# EAGLE design line-sensor-r2-var1b (EAGLE 9.3.1)
Assembly variants: I2C, USART, SPI

## Sheet 1 of 4
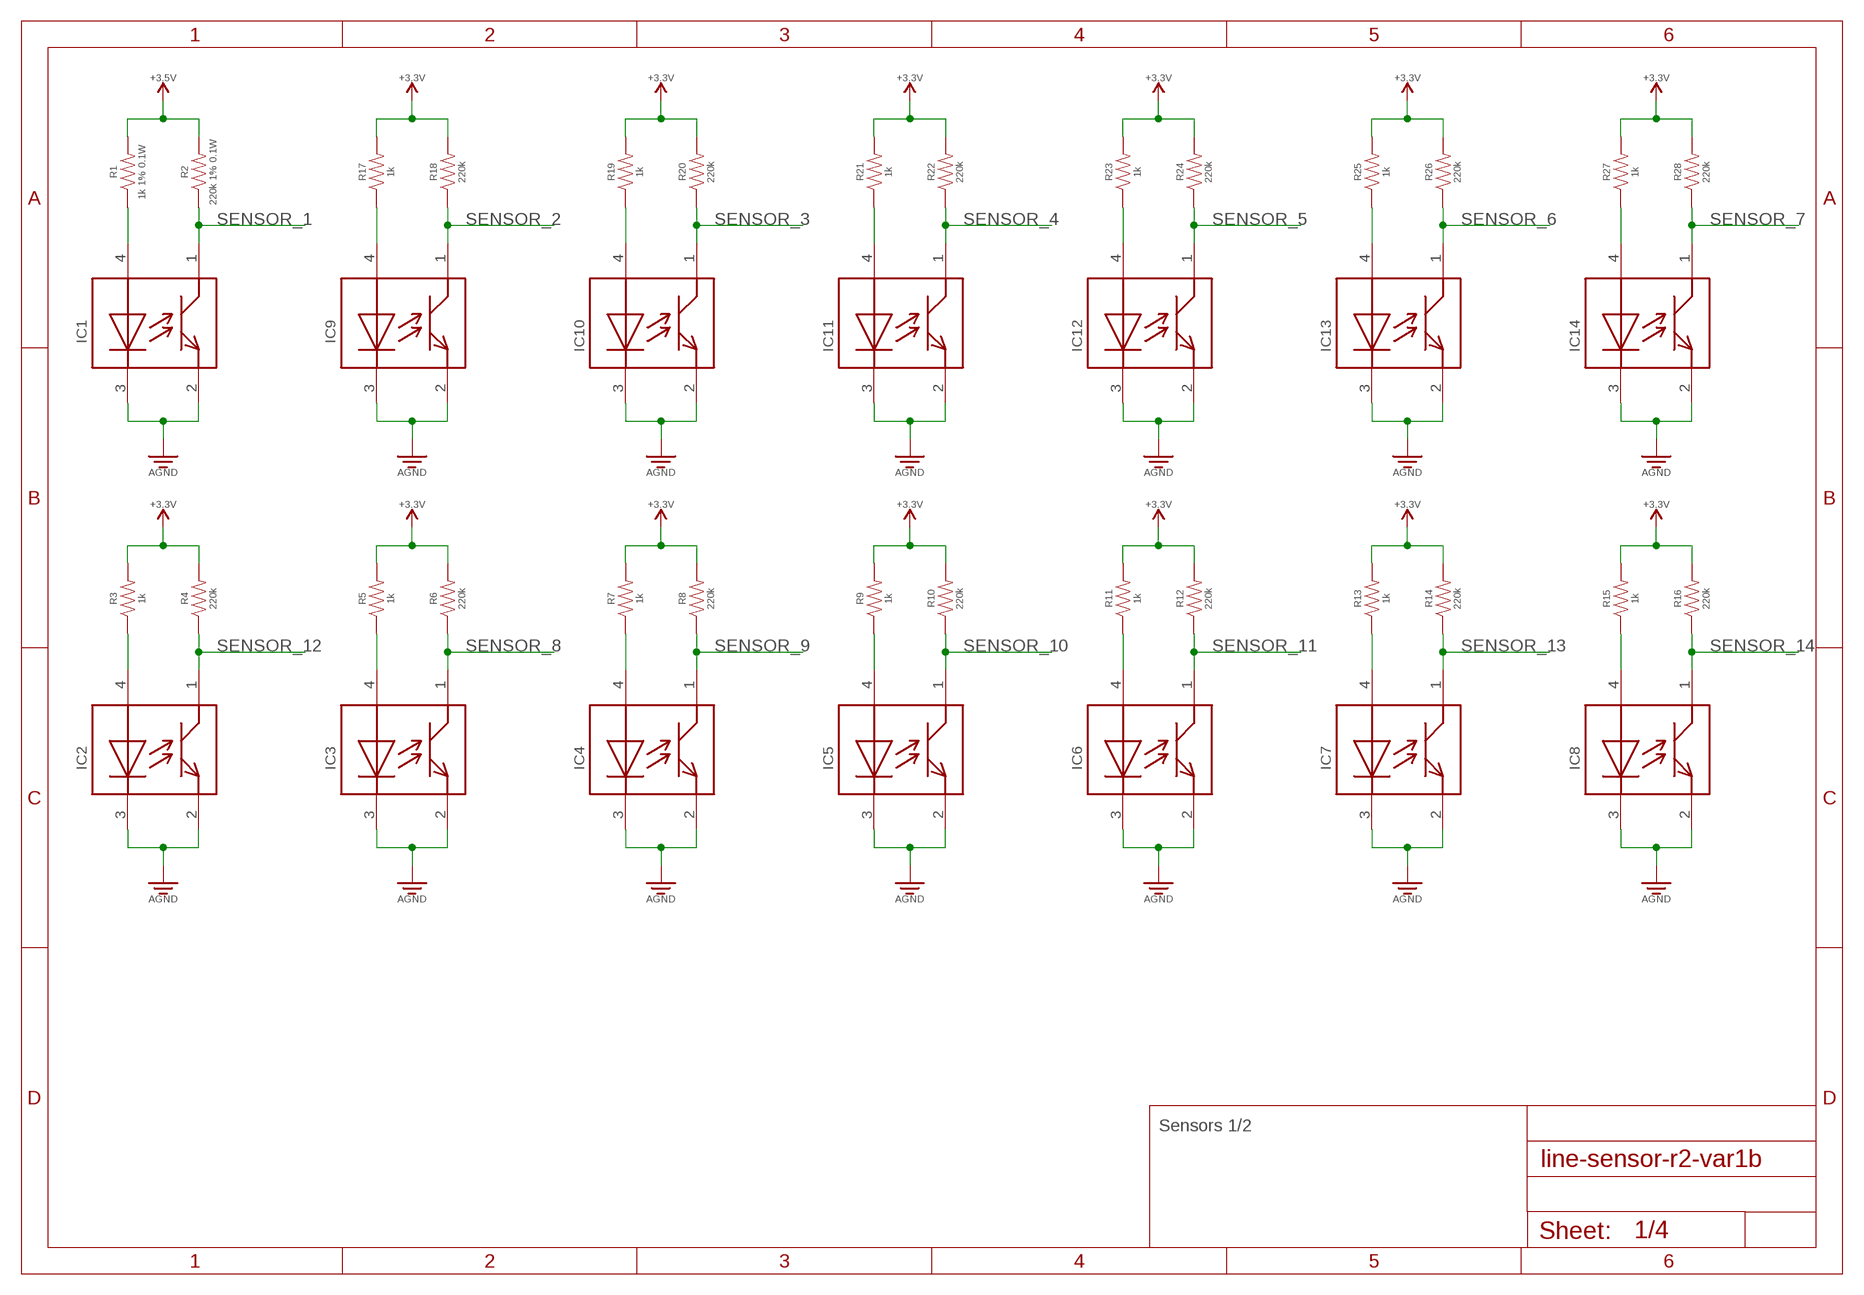
[diagram p0: schematic, sheet 1]

### Parts
IC1  GP2S60  [GP2S60]
IC2  GP2S60  [GP2S60]
IC3  GP2S60  [GP2S60]
IC4  GP2S60  [GP2S60]
IC5  GP2S60  [GP2S60]
IC6  GP2S60  [GP2S60]
IC7  GP2S60  [GP2S60]
IC8  GP2S60  [GP2S60]
IC9  GP2S60  [GP2S60]
IC10  GP2S60  [GP2S60]
IC11  GP2S60  [GP2S60]
IC12  GP2S60  [GP2S60]
IC13  GP2S60  [GP2S60]
IC14  GP2S60  [GP2S60]
R1  1k 1% 0.1W  RESISTOR_0.1W  [RESISTOR-0603]
R2  220k 1% 0.1W  RESISTOR_0.1W  [RESISTOR-0603]
R3  1k  RESISTOR_0.1W  [RESISTOR-0603]
R4  220k  RESISTOR_0.1W  [RESISTOR-0603]
R5  1k  RESISTOR_0.1W  [RESISTOR-0603]
R6  220k  RESISTOR_0.1W  [RESISTOR-0603]
R7  1k  RESISTOR_0.1W  [RESISTOR-0603]
R8  220k  RESISTOR_0.1W  [RESISTOR-0603]
R9  1k  RESISTOR_0.1W  [RESISTOR-0603]
R10  220k  RESISTOR_0.1W  [RESISTOR-0603]
R11  1k  RESISTOR_0.1W  [RESISTOR-0603]
R12  220k  RESISTOR_0.1W  [RESISTOR-0603]
R13  1k  RESISTOR_0.1W  [RESISTOR-0603]
R14  220k  RESISTOR_0.1W  [RESISTOR-0603]
R15  1k  RESISTOR_0.1W  [RESISTOR-0603]
R16  220k  RESISTOR_0.1W  [RESISTOR-0603]
R17  1k  RESISTOR_0.1W  [RESISTOR-0603]
R18  220k  RESISTOR_0.1W  [RESISTOR-0603]
R19  1k  RESISTOR_0.1W  [RESISTOR-0603]
R20  220k  RESISTOR_0.1W  [RESISTOR-0603]
R21  1k  RESISTOR_0.1W  [RESISTOR-0603]
R22  220k  RESISTOR_0.1W  [RESISTOR-0603]
R23  1k  RESISTOR_0.1W  [RESISTOR-0603]
R24  220k  RESISTOR_0.1W  [RESISTOR-0603]
R25  1k  RESISTOR_0.1W  [RESISTOR-0603]
R26  220k  RESISTOR_0.1W  [RESISTOR-0603]
R27  1k  RESISTOR_0.1W  [RESISTOR-0603]
R28  220k  RESISTOR_0.1W  [RESISTOR-0603]
SUPPLY2  +3.3V  (no package)
SUPPLY3  +3.3V  (no package)
SUPPLY4  +3.3V  (no package)
SUPPLY5  +3.3V  (no package)
SUPPLY6  +3.3V  (no package)
SUPPLY7  +3.3V  (no package)
SUPPLY8  +3.3V  (no package)
SUPPLY9  +3.3V  (no package)
SUPPLY10  +3.3V  (no package)
SUPPLY11  +3.3V  (no package)
SUPPLY12  +3.3V  (no package)
SUPPLY13  +3.3V  (no package)
SUPPLY14  +3.3V  (no package)
SUPPLY36  +3.5V  (no package)

### Nets
GND: IC1.2 IC1.3 IC2.2 IC2.3 IC3.2 IC3.3 IC4.2 IC4.3 IC5.2 IC5.3 IC6.2 IC6.3 IC7.2 IC7.3 IC8.2 IC8.3 IC9.2 IC9.3 IC10.2 IC10.3 IC11.2 IC11.3 IC12.2 IC12.3 IC13.2 IC13.3 IC14.2 IC14.3 ; supply symbol labelled AGND ; also sheet 2,3,4
N$1: IC9.4 R17.P$1
N$2: IC1.4 R1.P$1
N$3: IC10.4 R19.P$1
N$4: IC11.4 R21.P$1
N$5: IC12.4 R23.P$1
N$6: IC13.4 R25.P$1
N$7: IC14.4 R27.P$1
N$8: IC3.4 R5.P$1
N$9: IC4.4 R7.P$1
N$10: IC5.4 R9.P$1
N$11: IC6.4 R11.P$1
N$12: IC2.4 R3.P$1
N$13: IC7.4 R13.P$1
N$14: IC8.4 R15.P$1
SENSOR_1: IC1.1 R2.P$1 ; also sheet 3
SENSOR_2: IC9.1 R18.P$1 ; also sheet 3
SENSOR_3: IC10.1 R20.P$1 ; also sheet 3
SENSOR_4: IC11.1 R22.P$1 ; also sheet 3
SENSOR_5: IC12.1 R24.P$1 ; also sheet 3
SENSOR_6: IC13.1 R26.P$1 ; also sheet 3
SENSOR_7: IC14.1 R28.P$1 ; also sheet 3
SENSOR_8: IC3.1 R6.P$1 ; also sheet 3
SENSOR_9: IC4.1 R8.P$1 ; also sheet 3
SENSOR_10: IC5.1 R10.P$1 ; also sheet 3
SENSOR_11: IC6.1 R12.P$1 ; also sheet 3
SENSOR_12: IC2.1 R4.P$1 ; also sheet 3
SENSOR_13: IC7.1 R14.P$1 ; also sheet 3
SENSOR_14: IC8.1 R16.P$1 ; also sheet 3
VDD: R1.P$2 R2.P$2 R3.P$2 R4.P$2 R5.P$2 R6.P$2 R7.P$2 R8.P$2 R9.P$2 R10.P$2 R11.P$2 R12.P$2 R13.P$2 R14.P$2 R15.P$2 R16.P$2 R17.P$2 R18.P$2 R19.P$2 R20.P$2 R21.P$2 R22.P$2 R23.P$2 R24.P$2 R25.P$2 R26.P$2 R27.P$2 R28.P$2 SUPPLY2.VCC SUPPLY3.VCC SUPPLY4.VCC SUPPLY5.VCC SUPPLY6.VCC SUPPLY7.VCC SUPPLY8.VCC SUPPLY9.VCC SUPPLY10.VCC SUPPLY11.VCC SUPPLY12.VCC SUPPLY13.VCC SUPPLY14.VCC SUPPLY36.VCC ; also sheet 2,3,4

### Notes on the sheet
- Sensors 1/2

## Sheet 2 of 4
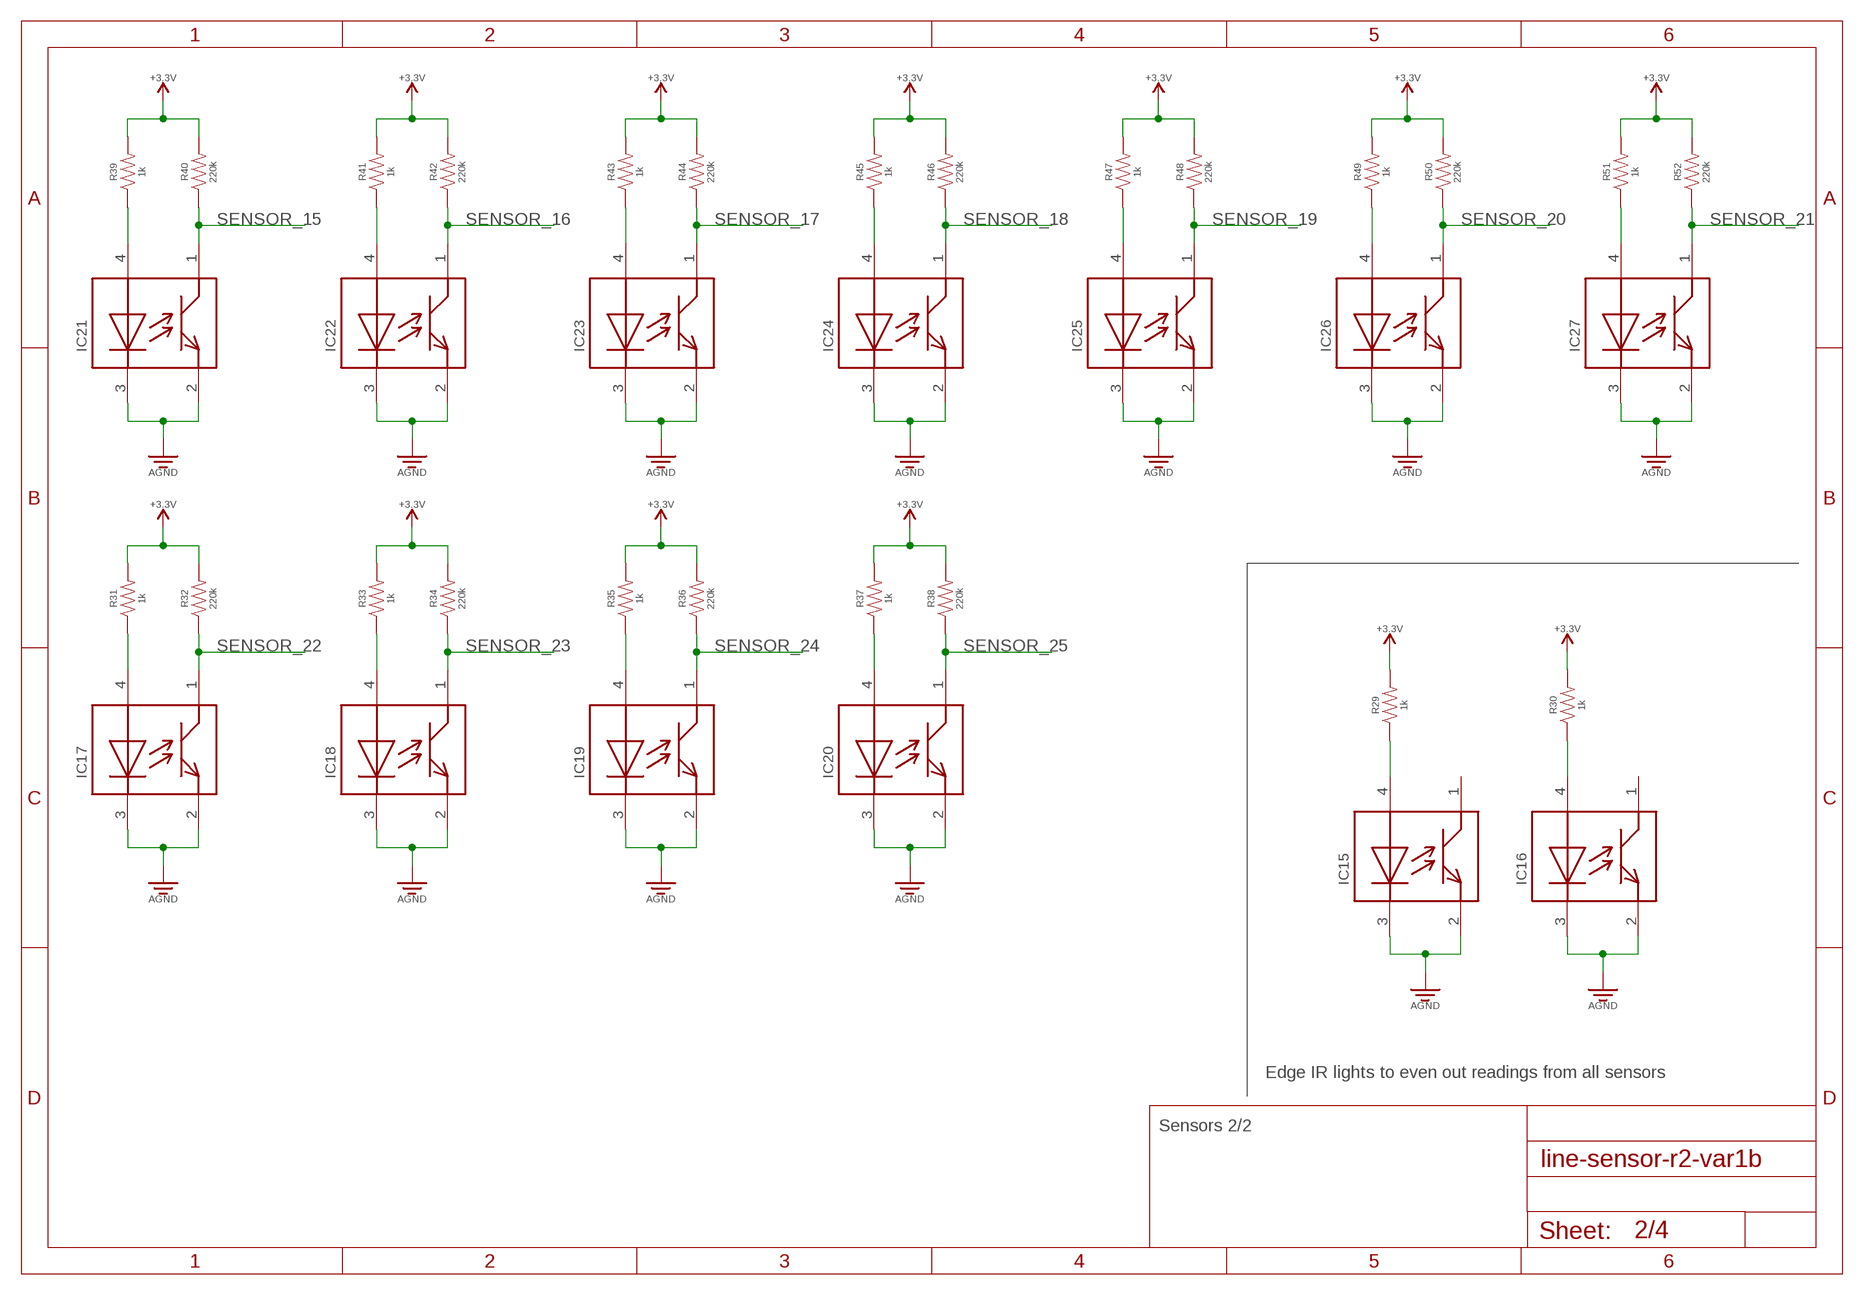
[diagram p1: schematic, sheet 2]

### Parts
IC15  GP2S60  [GP2S60]
IC16  GP2S60  [GP2S60]
IC17  GP2S60  [GP2S60]
IC18  GP2S60  [GP2S60]
IC19  GP2S60  [GP2S60]
IC20  GP2S60  [GP2S60]
IC21  GP2S60  [GP2S60]
IC22  GP2S60  [GP2S60]
IC23  GP2S60  [GP2S60]
IC24  GP2S60  [GP2S60]
IC25  GP2S60  [GP2S60]
IC26  GP2S60  [GP2S60]
IC27  GP2S60  [GP2S60]
R29  1k  RESISTOR_0.1W  [RESISTOR-0603]
R30  1k  RESISTOR_0.1W  [RESISTOR-0603]
R31  1k  RESISTOR_0.1W  [RESISTOR-0603]
R32  220k  RESISTOR_0.1W  [RESISTOR-0603]
R33  1k  RESISTOR_0.1W  [RESISTOR-0603]
R34  220k  RESISTOR_0.1W  [RESISTOR-0603]
R35  1k  RESISTOR_0.1W  [RESISTOR-0603]
R36  220k  RESISTOR_0.1W  [RESISTOR-0603]
R37  1k  RESISTOR_0.1W  [RESISTOR-0603]
R38  220k  RESISTOR_0.1W  [RESISTOR-0603]
R39  1k  RESISTOR_0.1W  [RESISTOR-0603]
R40  220k  RESISTOR_0.1W  [RESISTOR-0603]
R41  1k  RESISTOR_0.1W  [RESISTOR-0603]
R42  220k  RESISTOR_0.1W  [RESISTOR-0603]
R43  1k  RESISTOR_0.1W  [RESISTOR-0603]
R44  220k  RESISTOR_0.1W  [RESISTOR-0603]
R45  1k  RESISTOR_0.1W  [RESISTOR-0603]
R46  220k  RESISTOR_0.1W  [RESISTOR-0603]
R47  1k  RESISTOR_0.1W  [RESISTOR-0603]
R48  220k  RESISTOR_0.1W  [RESISTOR-0603]
R49  1k  RESISTOR_0.1W  [RESISTOR-0603]
R50  220k  RESISTOR_0.1W  [RESISTOR-0603]
R51  1k  RESISTOR_0.1W  [RESISTOR-0603]
R52  220k  RESISTOR_0.1W  [RESISTOR-0603]
SUPPLY15  +3.3V  (no package)
SUPPLY16  +3.3V  (no package)
SUPPLY17  +3.3V  (no package)
SUPPLY18  +3.3V  (no package)
SUPPLY19  +3.3V  (no package)
SUPPLY20  +3.3V  (no package)
SUPPLY21  +3.3V  (no package)
SUPPLY22  +3.3V  (no package)
SUPPLY23  +3.3V  (no package)
SUPPLY24  +3.3V  (no package)
SUPPLY25  +3.3V  (no package)
SUPPLY26  +3.3V  (no package)
SUPPLY27  +3.3V  (no package)

### Nets
GND: IC15.2 IC15.3 IC16.2 IC16.3 IC17.2 IC17.3 IC18.2 IC18.3 IC19.2 IC19.3 IC20.2 IC20.3 IC21.2 IC21.3 IC22.2 IC22.3 IC23.2 IC23.3 IC24.2 IC24.3 IC25.2 IC25.3 IC26.2 IC26.3 IC27.2 IC27.3 ; supply symbol labelled AGND ; also sheet 1,3,4
N$15: IC21.4 R39.P$1
N$16: IC22.4 R41.P$1
N$17: IC23.4 R43.P$1
N$18: IC24.4 R45.P$1
N$19: IC25.4 R47.P$1
N$20: IC26.4 R49.P$1
N$21: IC27.4 R51.P$1
N$22: IC17.4 R31.P$1
N$23: IC18.4 R33.P$1
N$24: IC19.4 R35.P$1
N$25: IC20.4 R37.P$1
N$30: IC16.4 R30.P$1
N$31: IC15.4 R29.P$1
SENSOR_15: IC21.1 R40.P$1 ; also sheet 3
SENSOR_16: IC22.1 R42.P$1 ; also sheet 3
SENSOR_17: IC23.1 R44.P$1 ; also sheet 3
SENSOR_18: IC24.1 R46.P$1 ; also sheet 3
SENSOR_19: IC25.1 R48.P$1 ; also sheet 3
SENSOR_20: IC26.1 R50.P$1 ; also sheet 3
SENSOR_21: IC27.1 R52.P$1 ; also sheet 3
SENSOR_22: IC17.1 R32.P$1 ; also sheet 3
SENSOR_23: IC18.1 R34.P$1 ; also sheet 3
SENSOR_24: IC19.1 R36.P$1 ; also sheet 3
SENSOR_25: IC20.1 R38.P$1 ; also sheet 3
VDD: R29.P$2 R30.P$2 R31.P$2 R32.P$2 R33.P$2 R34.P$2 R35.P$2 R36.P$2 R37.P$2 R38.P$2 R39.P$2 R40.P$2 R41.P$2 R42.P$2 R43.P$2 R44.P$2 R45.P$2 R46.P$2 R47.P$2 R48.P$2 R49.P$2 R50.P$2 R51.P$2 R52.P$2 SUPPLY15.VCC SUPPLY16.VCC SUPPLY17.VCC SUPPLY18.VCC SUPPLY19.VCC SUPPLY20.VCC SUPPLY21.VCC SUPPLY22.VCC SUPPLY23.VCC SUPPLY24.VCC SUPPLY25.VCC SUPPLY26.VCC SUPPLY27.VCC ; also sheet 1,3,4
Unconnected: IC15.1 IC16.1

### Notes on the sheet
- Edge IR lights to even out readings from all sensors
- Sensors 2/2

## Sheet 3 of 4
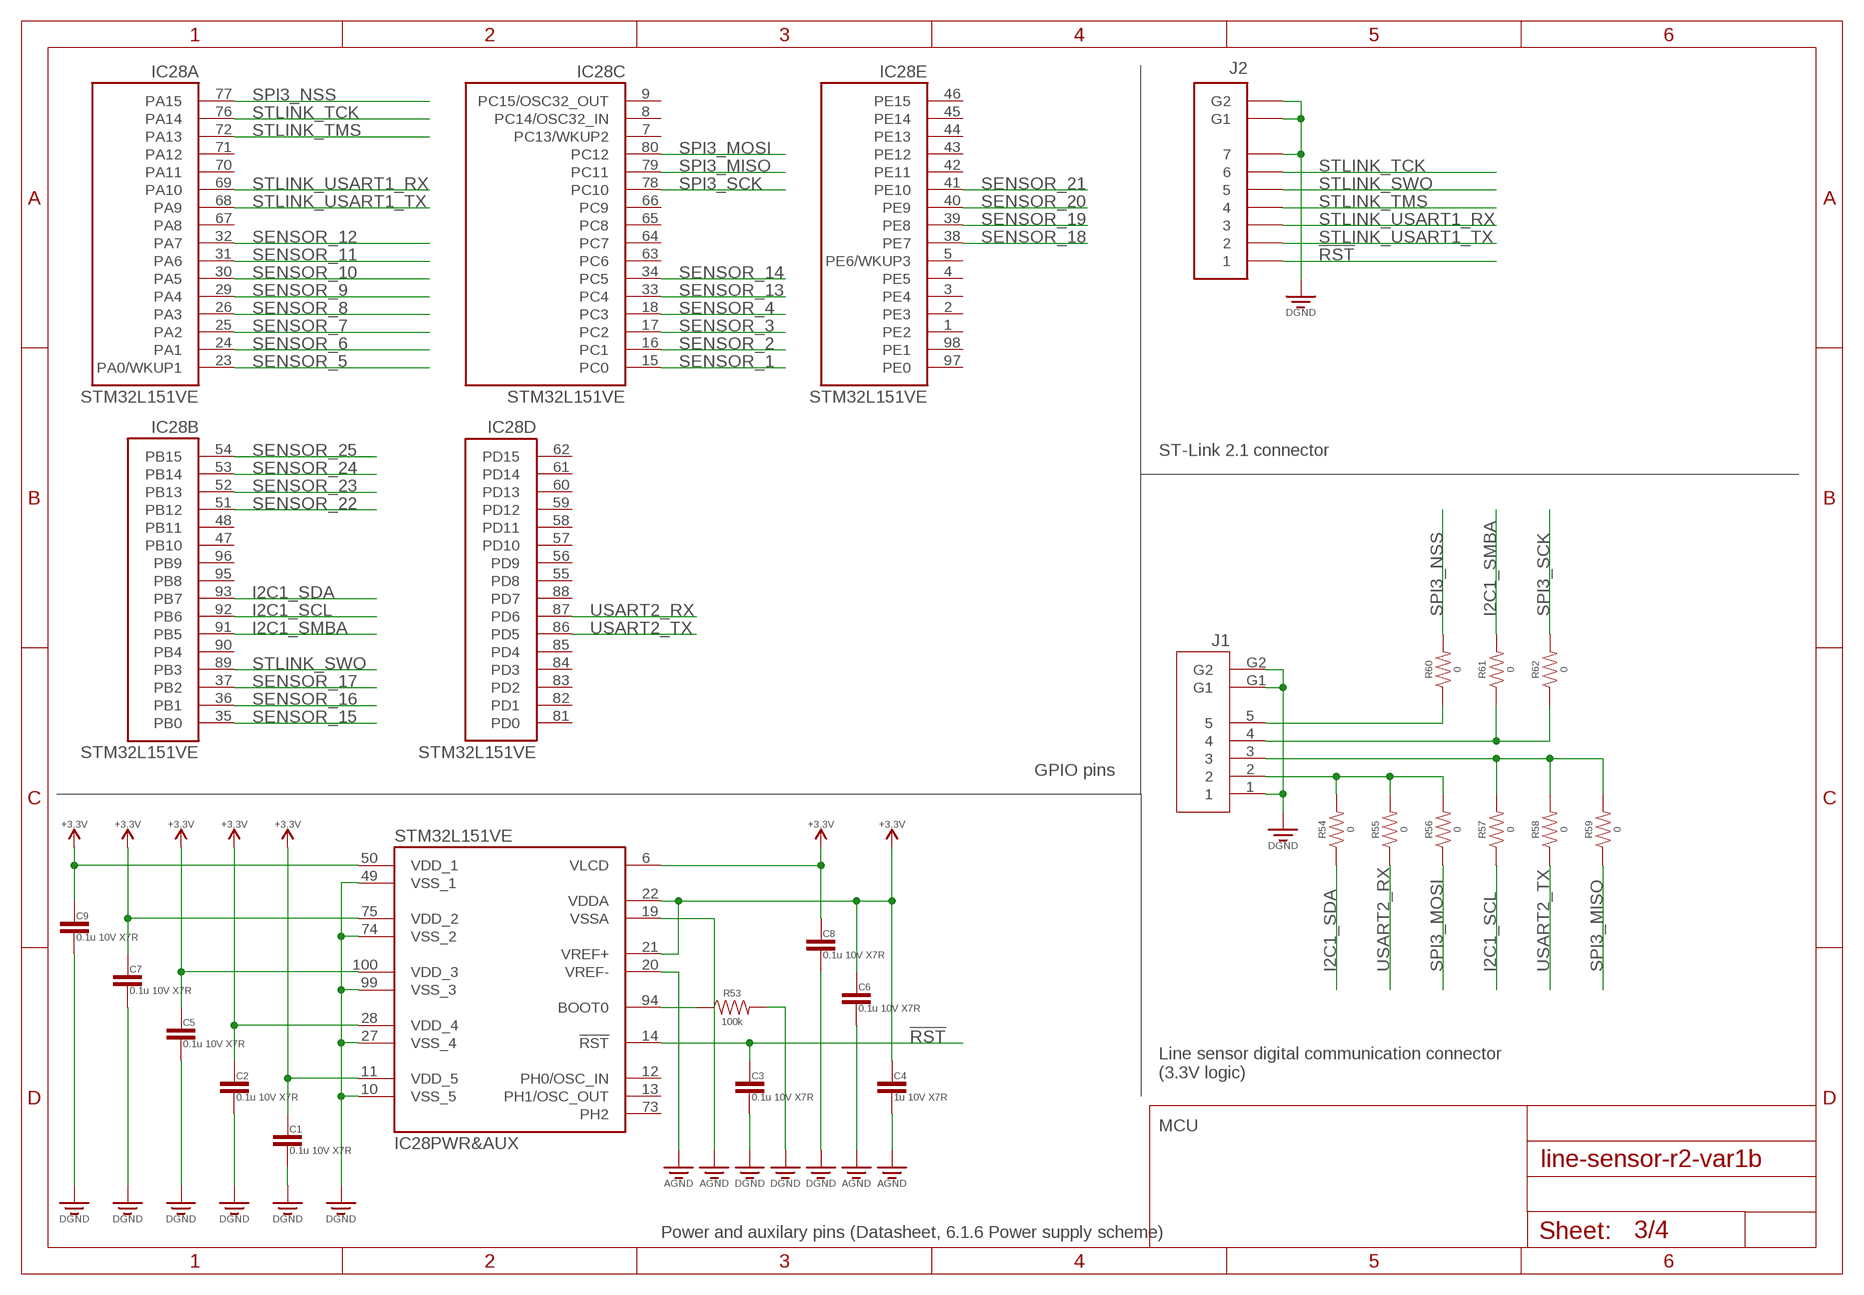
[diagram p2: schematic, sheet 3]

### Parts
C1  0.1u 10V X7R  CAPACITOR0603  [CAPACITOR-0603]
C2  0.1u 10V X7R  CAPACITOR0603  [CAPACITOR-0603]
C3  0.1u 10V X7R  CAPACITOR0603  [CAPACITOR-0603]
C4  1u 10V X7R  CAPACITOR0603  [CAPACITOR-0603]
C5  0.1u 10V X7R  CAPACITOR0603  [CAPACITOR-0603]
C6  0.1u 10V X7R  CAPACITOR0603  [CAPACITOR-0603]
C7  0.1u 10V X7R  CAPACITOR0603  [CAPACITOR-0603]
C8  0.1u 10V X7R  CAPACITOR0603  [CAPACITOR-0603]
C9  0.1u 10V X7R  CAPACITOR0603  [CAPACITOR-0603]
IC28  STM32L151VE  [LQFP100_14X14]
J1  MOLEX-502382-05XX  [MOLEX-502382-05XX]
J2  MOLEX-53261-0771  [MOLEX-53261-0771]
R53  100k  RESISTOR_0.1W  [RESISTOR-0603]
R54  0  RESISTOR_0.1W  [RESISTOR-0603]  (not fitted in variant USART)  (not fitted in variant SPI)
R55  0  RESISTOR_0.1W  [RESISTOR-0603]  (not fitted in variant I2C)  (not fitted in variant SPI)
R56  0  RESISTOR_0.1W  [RESISTOR-0603]  (not fitted in variant I2C)  (not fitted in variant USART)
R57  0  RESISTOR_0.1W  [RESISTOR-0603]  (not fitted in variant USART)  (not fitted in variant SPI)
R58  0  RESISTOR_0.1W  [RESISTOR-0603]  (not fitted in variant I2C)  (not fitted in variant SPI)
R59  0  RESISTOR_0.1W  [RESISTOR-0603]  (not fitted in variant I2C)  (not fitted in variant USART)
R60  0  RESISTOR_0.1W  [RESISTOR-0603]  (not fitted in variant I2C)  (not fitted in variant USART)
R61  0  RESISTOR_0.1W  [RESISTOR-0603]  (not fitted in variant USART)  (not fitted in variant SPI)
R62  0  RESISTOR_0.1W  [RESISTOR-0603]  (not fitted in variant I2C)  (not fitted in variant USART)
SUPPLY28  +3.3V  (no package)
SUPPLY29  +3.3V  (no package)
SUPPLY30  +3.3V  (no package)
SUPPLY31  +3.3V  (no package)
SUPPLY32  +3.3V  (no package)
SUPPLY33  +3.3V  (no package)
SUPPLY34  +3.3V  (no package)

### Nets
!RST: C3.1 IC28.14(PWR&AUX:!RST!) J2.1
BOOT0: IC28.94(PWR&AUX:BOOT0) R53.P$1
GND: C1.2 C2.2 C3.2 C4.2 C5.2 C6.2 C7.2 C8.2 C9.2 IC28.10(PWR&AUX:VSS_5) IC28.19(PWR&AUX:VSSA) IC28.20(PWR&AUX:VREF-) IC28.27(PWR&AUX:VSS_4) IC28.49(PWR&AUX:VSS_1) IC28.74(PWR&AUX:VSS_2) IC28.99(PWR&AUX:VSS_3) J1.1 J1.G1 J1.G2 J2.7 J2.G1 J2.G2 R53.P$2 ; supply symbol labelled DGND, AGND ; also sheet 1,2,4
I2C1_SCL: IC28.92(B:PB6) R57.P$1
I2C1_SDA: IC28.93(B:PB7) R54.P$1
I2C1_SMBA: IC28.91(B:PB5) R61.P$2
N$26: J1.2 R54.P$2 R55.P$2 R56.P$2
N$27: J1.3 R57.P$2 R58.P$2 R59.P$2
N$28: J1.4 R61.P$1 R62.P$1
N$29: J1.5 R60.P$1
SENSOR_1: IC28.15(C:PC0) ; also sheet 1
SENSOR_2: IC28.16(C:PC1) ; also sheet 1
SENSOR_3: IC28.17(C:PC2) ; also sheet 1
SENSOR_4: IC28.18(C:PC3) ; also sheet 1
SENSOR_5: IC28.23(A:PA0/WKUP1) ; also sheet 1
SENSOR_6: IC28.24(A:PA1) ; also sheet 1
SENSOR_7: IC28.25(A:PA2) ; also sheet 1
SENSOR_8: IC28.26(A:PA3) ; also sheet 1
SENSOR_9: IC28.29(A:PA4) ; also sheet 1
SENSOR_10: IC28.30(A:PA5) ; also sheet 1
SENSOR_11: IC28.31(A:PA6) ; also sheet 1
SENSOR_12: IC28.32(A:PA7) ; also sheet 1
SENSOR_13: IC28.33(C:PC4) ; also sheet 1
SENSOR_14: IC28.34(C:PC5) ; also sheet 1
SENSOR_15: IC28.35(B:PB0) ; also sheet 2
SENSOR_16: IC28.36(B:PB1) ; also sheet 2
SENSOR_17: IC28.37(B:PB2) ; also sheet 2
SENSOR_18: IC28.38(E:PE7) ; also sheet 2
SENSOR_19: IC28.39(E:PE8) ; also sheet 2
SENSOR_20: IC28.40(E:PE9) ; also sheet 2
SENSOR_21: IC28.41(E:PE10) ; also sheet 2
SENSOR_22: IC28.51(B:PB12) ; also sheet 2
SENSOR_23: IC28.52(B:PB13) ; also sheet 2
SENSOR_24: IC28.53(B:PB14) ; also sheet 2
SENSOR_25: IC28.54(B:PB15) ; also sheet 2
SPI3_MISO: IC28.79(C:PC11) R59.P$1
SPI3_MOSI: IC28.80(C:PC12) R56.P$1
SPI3_NSS: IC28.77(A:PA15) R60.P$2
SPI3_SCK: IC28.78(C:PC10) R62.P$2
STLINK_SWO: IC28.89(B:PB3) J2.5
STLINK_TCK: IC28.76(A:PA14) J2.6
STLINK_TMS: IC28.72(A:PA13) J2.4
STLINK_USART1_RX: IC28.69(A:PA10) J2.3
STLINK_USART1_TX: IC28.68(A:PA9) J2.2
USART2_RX: IC28.87(D:PD6) R55.P$1
USART2_TX: IC28.86(D:PD5) R58.P$1
VDD: C1.1 C2.1 C4.1 C5.1 C6.1 C7.1 C8.1 C9.1 IC28.6(PWR&AUX:VLCD) IC28.11(PWR&AUX:VDD_5) IC28.21(PWR&AUX:VREF+) IC28.22(PWR&AUX:VDDA) IC28.28(PWR&AUX:VDD_4) IC28.50(PWR&AUX:VDD_1) IC28.75(PWR&AUX:VDD_2) IC28.100(PWR&AUX:VDD_3) SUPPLY28.VCC SUPPLY29.VCC SUPPLY30.VCC SUPPLY31.VCC SUPPLY32.VCC SUPPLY33.VCC SUPPLY34.VCC ; also sheet 1,2,4
Unconnected: IC28.1(E:PE2) IC28.2(E:PE3) IC28.3(E:PE4) IC28.4(E:PE5) IC28.5(E:PE6/WKUP3) IC28.7(C:PC13/WKUP2) IC28.8(C:PC14/OSC32_IN) IC28.9(C:PC15/OSC32_OUT) IC28.12(PWR&AUX:PH0/OSC_IN) IC28.13(PWR&AUX:PH1/OSC_OUT) IC28.42(E:PE11) IC28.43(E:PE12) IC28.44(E:PE13) IC28.45(E:PE14) IC28.46(E:PE15) IC28.47(B:PB10) IC28.48(B:PB11) IC28.55(D:PD8) IC28.56(D:PD9) IC28.57(D:PD10) IC28.58(D:PD11) IC28.59(D:PD12) IC28.60(D:PD13) IC28.61(D:PD14) IC28.62(D:PD15) IC28.63(C:PC6) IC28.64(C:PC7) IC28.65(C:PC8) IC28.66(C:PC9) IC28.67(A:PA8) IC28.70(A:PA11) IC28.71(A:PA12) IC28.73(PWR&AUX:PH2) IC28.81(D:PD0) IC28.82(D:PD1) IC28.83(D:PD2) IC28.84(D:PD3) IC28.85(D:PD4) IC28.88(D:PD7) IC28.90(B:PB4) IC28.95(B:PB8) IC28.96(B:PB9) IC28.97(E:PE0) IC28.98(E:PE1)

### Notes on the sheet
- ST-Link 2.1 connector
- GPIO pins
- Line sensor digital communication connector
  (3.3V logic)
- MCU
- Power and auxilary pins (Datasheet, 6.1.6 Power supply scheme)

## Sheet 4 of 4
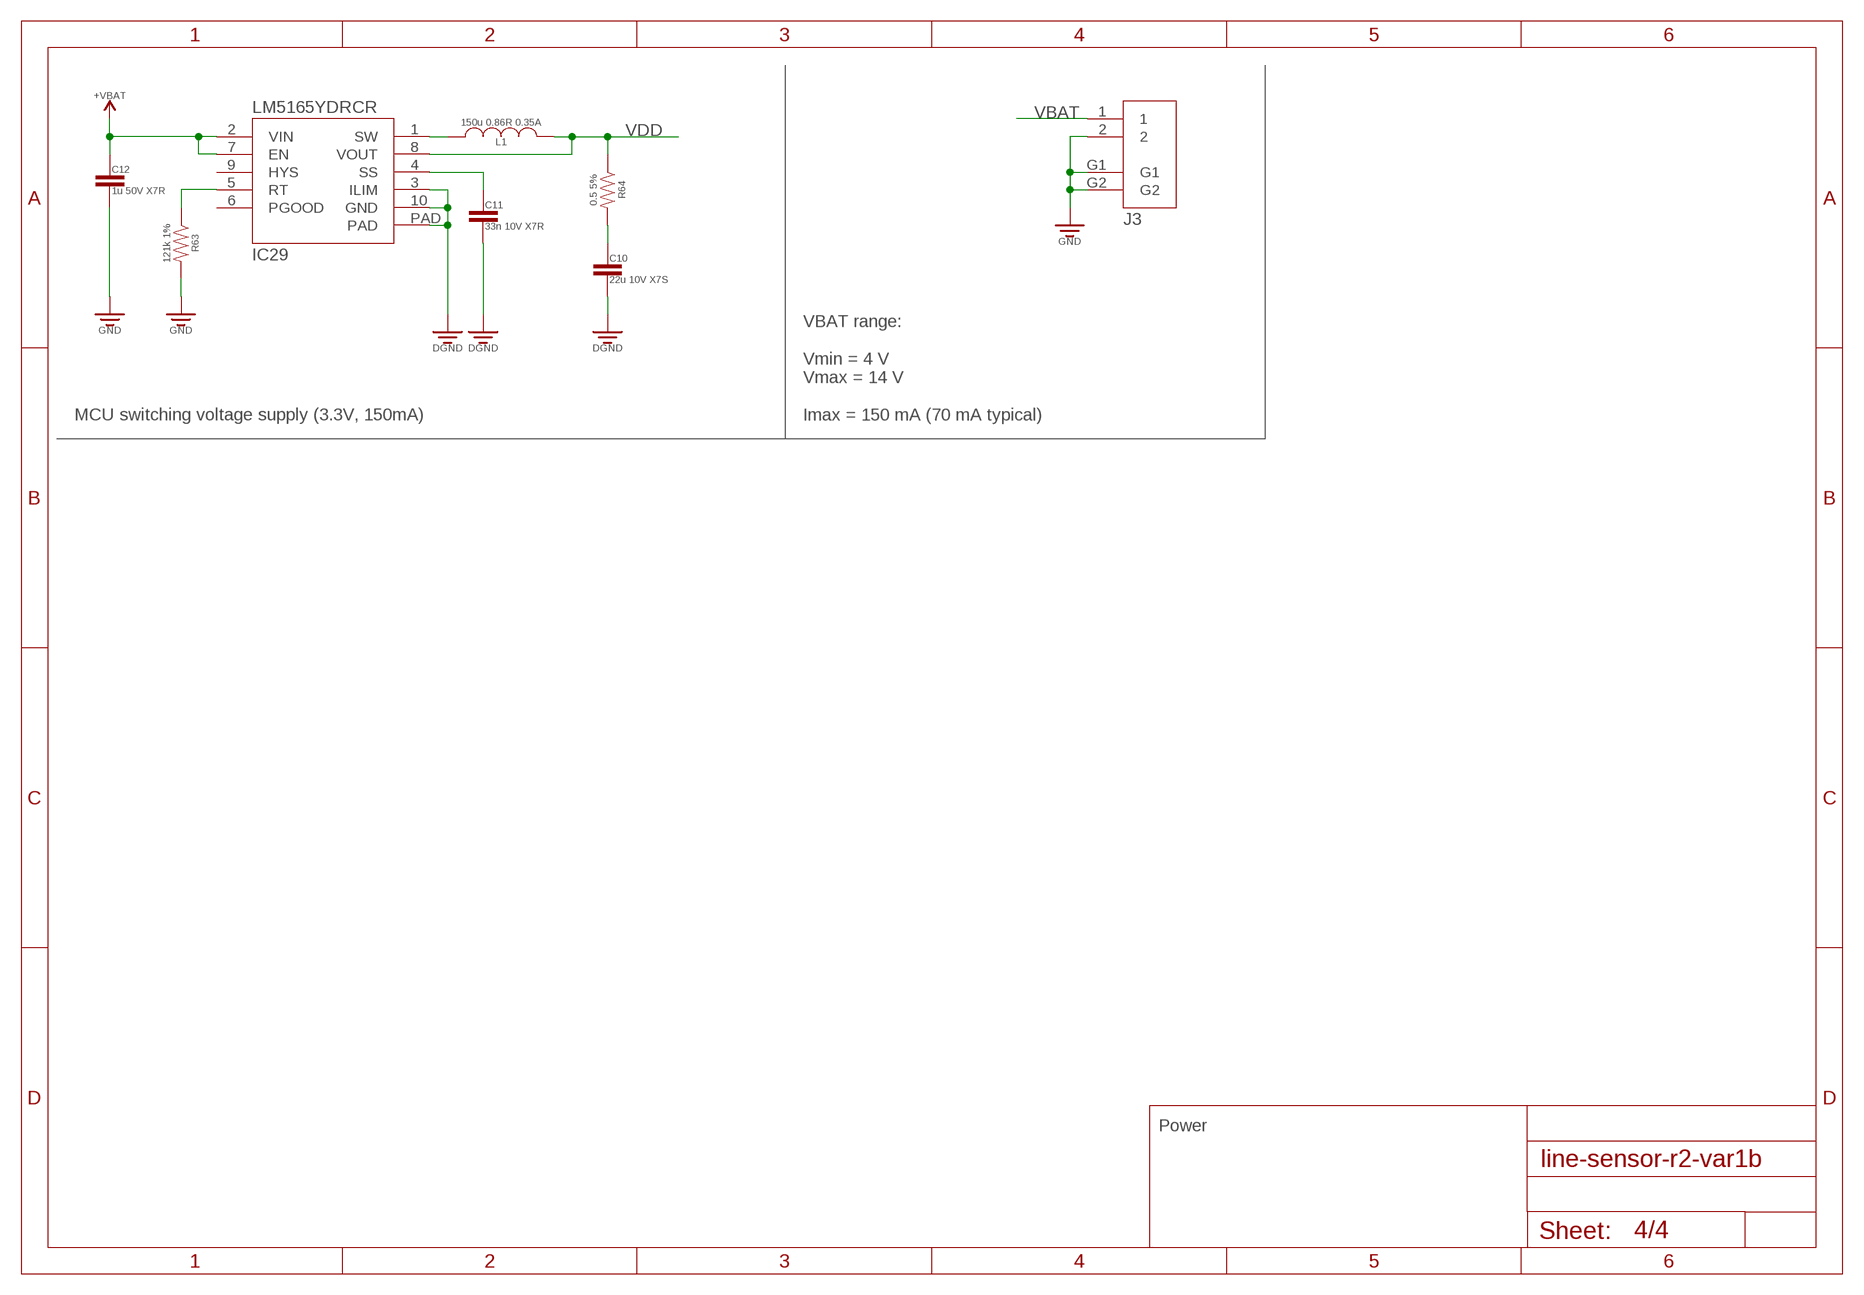
[diagram p3: schematic, sheet 4]

### Parts
C10  22u 10V X7S  CAPACITOR0805  [CAPACITOR-0805]
C11  33n 10V X7R  CAPACITOR0603  [CAPACITOR-0603]
C12  1u 50V X7R  CAPACITOR1206  [CAPACITOR-1206]
IC29  LM5165YDRCR  [VSON-10-0.5MM]
J3  MOLEX-502382-02XX  [MOLEX-502382-02XX]
L1  150u 0.86R 0.35A  INDUCTORPANASONIC-SERIES-H  [PANASONIC-SERIES-H]
R63  121k 1%  RESISTOR0603  [RESISTOR-0603]
R64  0.5 5%  RESISTOR0603  [RESISTOR-0603]
SUPPLY35  +VBAT  (no package)

### Nets
GND: C10.2 C11.2 C12.P$2 IC29.3(ILIM) IC29.10(GND) IC29.PAD J3.2 J3.G1 J3.G2 R63.P$2 ; supply symbol labelled DGND ; also sheet 1,2,3
IC32_SW: IC29.1(SW) L1.1
N$35: IC29.5(RT) R63.P$1
N$40: C11.1 IC29.4(SS)
N$42: C10.1 R64.P$2
VBAT: C12.P$1 IC29.2(VIN) IC29.7(EN) J3.1 SUPPLY35.VCC
VDD: IC29.8(VOUT) L1.2 R64.P$1 ; also sheet 1,2,3
Unconnected: IC29.6(PGOOD) IC29.9(HYS)

### Notes on the sheet
- MCU switching voltage supply (3.3V, 150mA)
- VBAT range:
  
  Vmin = 4 V
  Vmax = 14 V
  
  Imax = 150 mA (70 mA typical)
- Power

## Library data of the parts
C1-C9 = capacitors:CAPACITOR
C10-C12 = passives:CAPACITOR
IC1-IC27 = sensors:GP2S60: SMT Compact Reﬂective Photointerrupter Datasheet: http://www.sharp-world.com/products/device/lineup/data/pdf/datasheet/gp2s60_e.pdf
IC28 = mcu:STM32L151VE
IC29 = voltage-regulator:LM5165YDRCR: Texas Instruments V in: 3...65 V V out: 3.3 V I out: 150 mA Frequency: <= 600kHz
J1 = connectors:MOLEX-502382-05XX
J2 = connectors:MOLEX-53261-0771
J3 = connectors:MOLEX-502382-02XX
L1 = passives:INDUCTOR
R1-R62 = resistors:RESISTOR_0.1W
R63 R64 = passives:RESISTOR
SUPPLY2-SUPPLY34 = voltage-ground:+3.3V: +3.3V Voltage Supply Positive voltage supply (traditionally for a BJT device, C=collector).
SUPPLY35 = voltage-ground:+VBAT: +3.3V Voltage Supply Positive voltage supply (traditionally for a BJT device, C=collector).
SUPPLY36 = voltage-ground:+3.5V: +3.5V Voltage Supply Positive voltage supply (traditionally for a BJT device, C=collector).

## Net classes
1 ground: width 0.3 mm
2 3v3: width 0.3 mm

## Board
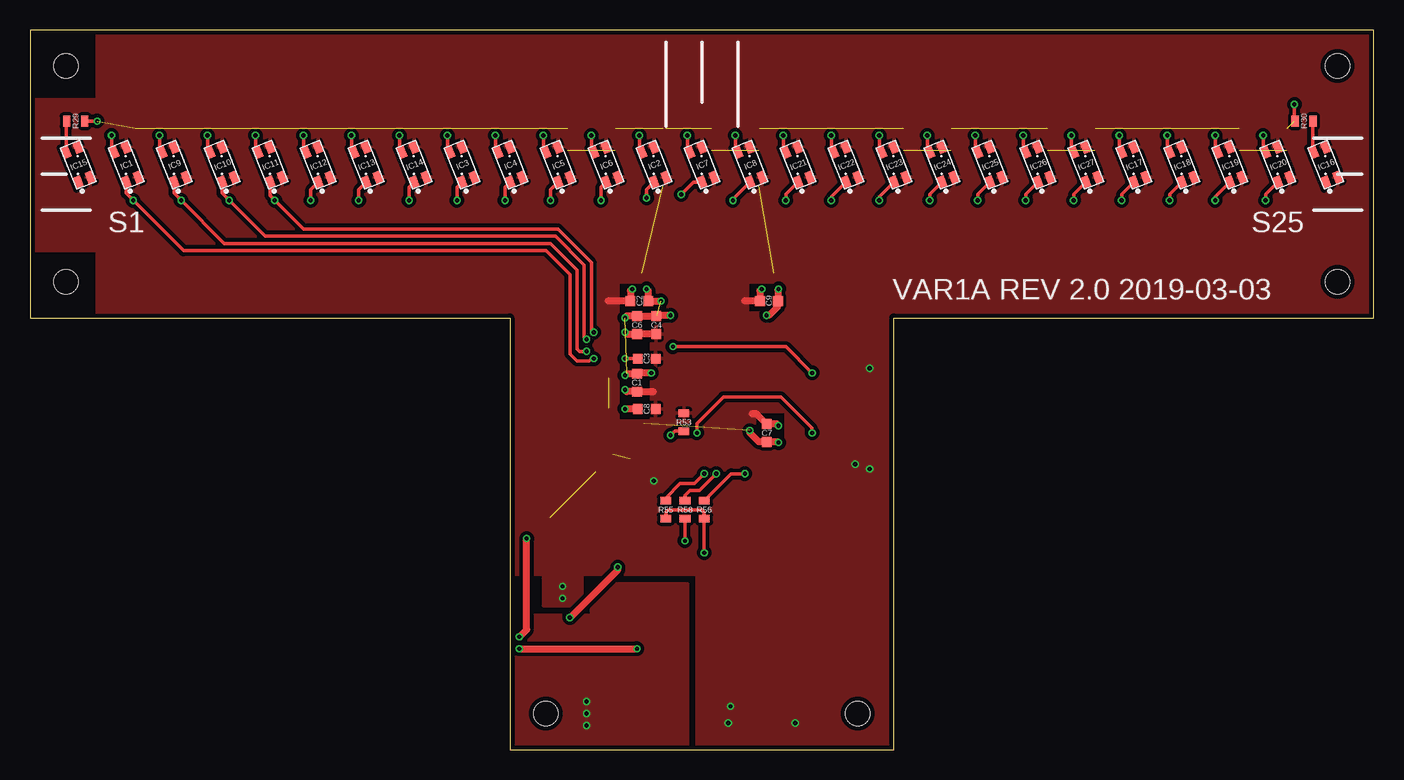
[diagram p4: board, top side]
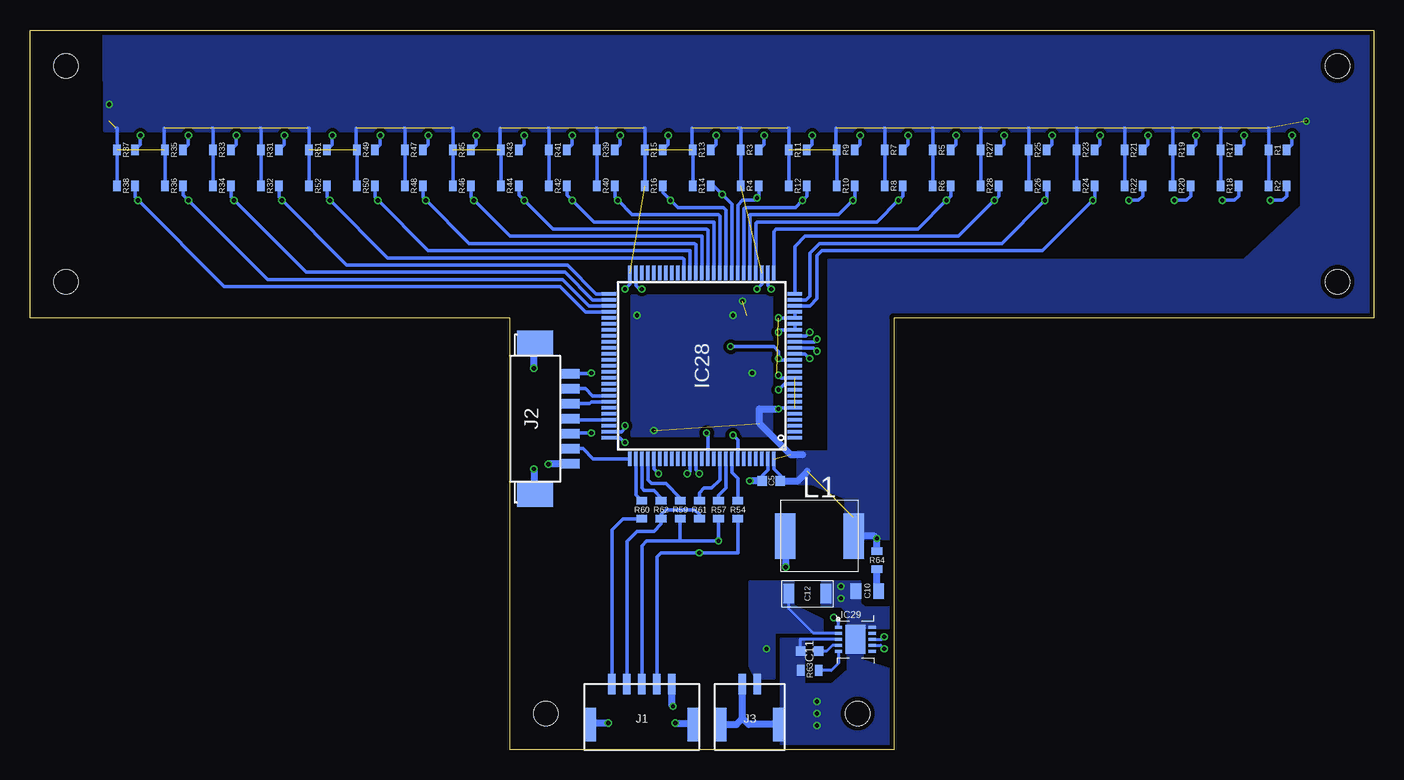
[diagram p5: board, bottom side, seen from below]

Size 112 x 60 mm. Coordinates in mm from the lower left corner, seen from the top.
Outline: 0,36 40,36 40,0 72,0 72,36 112,36 112,60 0,60 0,36
Copper layers (1*16): Top 0.035559375mm / dielectric 1.6mm / Bottom 0.035559375mm
Design rules "oshpark-2layer *": minimum track width 6mil, minimum drill 10mil, track to track 6mil, track to pad 6mil, pad to pad 6mil, via to via 6mil, smd to smd 6mil, copper to edge 15mil, drill to drill 6mil, minimum pad ring 5mil, minimum via ring 5mil, stop-mask expansion 2.5mil, vias tented up to drill 0mil, thermal gap 10mil
Holes 2 mm at 3,57 3,39 109,57 109,39 43,3 69,3

### Footprints (pad centres in the part's own frame; a part is rotated, then mirrored left to right if it is on the bottom)
CAPACITOR-0603 = smd 0.8 x 0.8: 1 -0.75,0; 2 0.75,0
CAPACITOR-0805 = smd 0.9 x 1.3: 1 -0.95,0; 2 0.95,0
CAPACITOR-1206 = smd 0.9 x 1.6: P$1 -1.55,0; P$2 1.55,0
GP2S60 = smd 1 x 0.65: 1 -0.65,0.25; 2 -0.65,-0.85; 3 2.05,-0.85; 4 2.05,0.25
LQFP100_14X14 = smd 0.3 x 1.2: 1 -6,-7.75; 2 -5.5,-7.75; 3 -5,-7.75; 4 -4.5,-7.75; 5 -4,-7.75; 6 -3.5,-7.75; 7 -3,-7.75; 8 -2.5,-7.75; 9 -2,-7.75; 10 -1.5,-7.75; 11 -1,-7.75; 12 -0.5,-7.75; 13 0,-7.75; 14 0.5,-7.75; 15 1,-7.75; 16 1.5,-7.75; 17 2,-7.75; 18 2.5,-7.75; 19 3,-7.75; 20 3.5,-7.75; 21 4,-7.75; 22 4.5,-7.75; 23 5,-7.75; 24 5.5,-7.75; 25 6,-7.75; 51 6,7.75; 52 5.5,7.75; 53 5,7.75; 54 4.5,7.75; 55 4,7.75; 56 3.5,7.75; 57 3,7.75; 58 2.5,7.75; 59 2,7.75; 60 1.5,7.75; 61 1,7.75; 62 0.5,7.75; 63 0,7.75; 64 -0.5,7.75; 65 -1,7.75; 66 -1.5,7.75; 67 -2,7.75; 68 -2.5,7.75; 69 -3,7.75; 70 -3.5,7.75; 71 -4,7.75; 72 -4.5,7.75; 73 -5,7.75; 74 -5.5,7.75; 75 -6,7.75 | smd 1.2 x 0.3: 26 7.75,-6; 27 7.75,-5.5; 28 7.75,-5; 29 7.75,-4.5; 30 7.75,-4; 31 7.75,-3.5; 32 7.75,-3; 33 7.75,-2.5; 34 7.75,-2; 35 7.75,-1.5; 36 7.75,-1; 37 7.75,-0.5; 38 7.75,0; 39 7.75,0.5; 40 7.75,1; 41 7.75,1.5; 42 7.75,2; 43 7.75,2.5; 44 7.75,3; 45 7.75,3.5; 46 7.75,4; 47 7.75,4.5; 48 7.75,5; 49 7.75,5.5; 50 7.75,6; 76 -7.75,6; 77 -7.75,5.5; 78 -7.75,5; 79 -7.75,4.5; 80 -7.75,4; 81 -7.75,3.5; 82 -7.75,3; 83 -7.75,2.5; 84 -7.75,2; 85 -7.75,1.5; 86 -7.75,1; 87 -7.75,0.5; 88 -7.75,0; 89 -7.75,-0.5; 90 -7.75,-1; 91 -7.75,-1.5; 92 -7.75,-2; 93 -7.75,-2.5; 94 -7.75,-3; 95 -7.75,-3.5; 96 -7.75,-4; 97 -7.75,-4.5; 98 -7.75,-5; 99 -7.75,-5.5; 100 -7.75,-6
VSON-10-0.5MM = smd 0.6 x 0.24: 1 -1.4,1; 2 -1.4,0.5; 3 -1.4,0; 4 -1.4,-0.5; 5 -1.4,-1; 6 1.4,-1; 7 1.4,-0.5; 8 1.4,0; 9 1.4,0.5; 10 1.4,1 | smd 1.65 x 2.4: PAD 0,0
MOLEX-502382-05XX = smd 0.6 x 1.7: 1 -2.5,-5.45; 2 -1.25,-5.45; 3 0,-5.45; 4 1.25,-5.45; 5 2.5,-5.45 | smd 1 x 2.8: G1 -4.3,-2.1; G2 4.3,-2.1
MOLEX-53261-0771 = smd 0.8 x 1.6: 1 -3.75,-0.8; 2 -2.5,-0.8; 3 -1.25,-0.8; 4 0,-0.8; 5 1.25,-0.8; 6 2.5,-0.8; 7 3.75,-0.8 | smd 2.1 x 3: G1 -6.3,-3.7; G2 6.3,-3.7
MOLEX-502382-02XX = smd 0.6 x 1.7: 1 -0.625,-5.45; 2 0.625,-5.45 | smd 1 x 2.8: G1 -2.425,-2.1; G2 2.425,-2.1
PANASONIC-SERIES-H = smd 1.7 x 3.8: 1 -2.85,0; 2 2.85,0
RESISTOR-0603 = smd 0.6 x 0.9: P$1 -0.75,0; P$2 0.75,0

### Placement (x,y rotation side)
C1  50.6,30.6 270 top
C2  50.8,37.4 180 top
C3  51.4,32.6 0 top
C4  52.2,35.4 270 top
C5  50.2,22.4 180 bottom
C6  50.6,35.4 270 top
C7  61.4,26.4 90 top
C8  51.4,28.4 0 top
C9  61.6,37.4 180 top
C10  42.2,13.2 180 bottom
C11  47,8.2 180 bottom
C12  47.2,13 0 bottom
IC1  8,48 111.8 top
IC2  52,48 111.8 top
IC3  36,48 111.8 top
IC4  40,48 111.8 top
IC5  44,48 111.8 top
IC6  48,48 111.8 top
IC7  56,48 111.8 top
IC8  60,48 111.8 top
IC9  12,48 111.8 top
IC10  16,48 111.8 top
IC11  20,48 111.8 top
IC12  24,48 111.8 top
IC13  28,48 111.8 top
IC14  32,48 111.8 top
IC15  4,48 111.8 top
IC16  108,48 111.8 top
IC17  92,48 111.8 top
IC18  96,48 111.8 top
IC19  100,48 111.8 top
IC20  104,48 111.8 top
IC21  64,48 111.8 top
IC22  68,48 111.8 top
IC23  72,48 111.8 top
IC24  76,48 111.8 top
IC25  80,48 111.8 top
IC26  84,48 111.8 top
IC27  88,48 111.8 top
IC28  56,32 90 bottom
IC29  43.2,9.2 0 bottom
J1  61,0 180 bottom
J2  66.2,27.6 270 bottom
J3  52,0 180 bottom
L1  46.2,17.8 0 bottom
R1  8,50 180 bottom
R2  8,47 180 bottom
R3  52,50 180 bottom
R4  52,47 180 bottom
R5  36,50 180 bottom
R6  36,47 180 bottom
R7  40,50 180 bottom
R8  40,47 180 bottom
R9  44,50 180 bottom
R10  44,47 180 bottom
R11  48,50 180 bottom
R12  48,47 180 bottom
R13  56,50 180 bottom
R14  56,47 180 bottom
R15  60,50 180 bottom
R16  60,47 180 bottom
R17  12,50 180 bottom
R18  12,47 180 bottom
R19  16,50 180 bottom
R20  16,47 180 bottom
R21  20,50 180 bottom
R22  20,47 180 bottom
R23  24,50 180 bottom
R24  24,47 180 bottom
R25  28,50 180 bottom
R26  28,47 180 bottom
R27  32,50 180 bottom
R28  32,47 180 bottom
R29  3.8,52.4 0 top
R30  106.2,52.4 180 top
R31  92,50 180 bottom
R32  92,47 180 bottom
R33  96,50 180 bottom
R34  96,47 180 bottom
R35  100,50 180 bottom
R36  100,47 180 bottom
R37  104,50 180 bottom
R38  104,47 180 bottom
R39  64,50 180 bottom
R40  64,47 180 bottom
R41  68,50 180 bottom
R42  68,47 180 bottom
R43  72,50 180 bottom
R44  72,47 180 bottom
R45  76,50 180 bottom
R46  76,47 180 bottom
R47  80,50 180 bottom
R48  80,47 180 bottom
R49  84,50 180 bottom
R50  84,47 180 bottom
R51  88,50 180 bottom
R52  88,47 180 bottom
R53  54.5,27.3 90 top
R54  53,20 270 bottom
R55  53,20 270 top
R56  56.2,20 270 top
R57  54.6,20 270 bottom
R58  54.6,20 270 top
R59  57.8,20 270 bottom
R60  61,20 90 bottom
R61  56.2,20 90 bottom
R62  59.4,20 90 bottom
R63  47,6.6 180 bottom
R64  41.4,15.8 270 bottom

### Tracks (layer width: path | path; a pad name or v marks a point on that pad's centre or on a via)
!RST  (via drill 0.35)
  Top 0.3: v49.6,32.6 C3.1 | v53.6,33.6 63,33.6 v65.2,31.4
  Bottom 0.3: IC28.14 49.5,32.5 v49.6,32.6 49.6,33.2 50,33.6 v53.6,33.6 | v65.2,31.4 65.25,31.35 J2.1
BOOT0  (via drill 0.35)
  Top 0.3: v53.4,26.2 53.75,26.55 R53.P$1
  Bottom 0.3: IC28.94 53,25.8 v53.4,26.2
GND  (via drill 0.35)
  Top 0.6: v50.2,38.4 50.05,38.25 C2.2 48.2,37.4 | v49.6,34.8 49.75,34.65 C6.2 C4.2 | v49.6,30 49.75,29.85 C1.2 51.95,29.85 | v62.4,27 62.25,27.15 C7.2 60.55,28 60.2,28 | v61,38.4 60.85,38.25 C9.2 59.6,37.4
  Bottom 0.24: C11.2 47.8,8.25 47.8,9.2 IC29.3
  Bottom 0.3: IC28.74 62.7,26.5 62.4,26.8 v62.4,27 | IC28.49 61.5,38.7 61.2,38.4 v61,38.4 | IC28.27 50.5,38.7 v50.2,38.4 | IC28.20 IC28.19 49.4,35 v49.6,34.8 | IC28.10 49.1,30.5 v49.6,30 | IC28.99 50.5,23.3 50.95,22.85 C5.2
  Bottom 0.6: J3.G2 53.1,2.1 52.6,2.6 | 52.6,2.6 52.62,2.62 J3.2 | J3.G1 52.1,2.1 52.6,2.6 | v63.8,2.2 65.2,2.2 J1.G2 | v58.2,2.2 56.8,2.2 J1.G1 | v58.4,3.6 58.5,3.7 J1.1 | v70,31.8 70,33.8 J2.G1 | v70,23.4 70,21.4 J2.G2 | v68.8,23.8 68.75,23.85 J2.7 | C5.2 v52,22.4
  other vias: 44.4,12.6 44.4,13.6 46.4,4 46.4,3 46.4,2
  pour Bottom (isolate 0.24, no thermals): 47.5,9.2 49.4,9.2 49.4,0.2 40.2,0.2 40.2,6.6 42.6,7.4 42.6,8.2 43.8,8.2 43.8,6.62 45.2,5.4 47.5,5.4
  pour Bottom (no thermals): 43.8,10.2 40.2,10.2 40.2,11.8 42.4,11.8 42.8,12.2 42.8,14 46,14 46,12 44.4,12 43.8,11.4
  pour Top (isolate 0.3): 71.8,0.2 55.6,0.2 55.6,14.6 46,14.6 46,12 42.8,12 42.8,14.6 40.2,14.6 40.2,36.2 5.6,36.2 5.6,41.6 0.2,41.6 0.2,54.2 5.6,54.2 5.6,59.8 111.8,59.8 111.8,36.2 63,36.2 63,39 49,39 49,25 63,25 63,36 71.8,36
  pour Top (isolate 0.3): 40.2,0.2 54.8,0.2 54.8,13.8 49.2,13.8 46.8,13.8 46.8,11.2 42,11.2 42,13.8 40.2,13.8
  pour Top (isolate 0.3): 63.4,36.4 59.8,36.4 59.8,39.2 51.8,39.2 51.8,27.4 48.8,27.4 48.8,24.8 60.4,24.8 60.4,28.2 63.4,28.2
I2C1_SCL
  Bottom 0.3: R57.P$1 54.6,21.2 54,21.8 IC28.92
I2C1_SDA
  Bottom 0.3: R54.P$1 53,22.6 53.5,23.1 IC28.93
I2C1_SMBA
  Bottom 0.3: IC28.91 54.5,22.5 55.2,21.8 55.8,21.8 56.2,21.4 R61.P$2
IC32_SW  (via drill 0.35)
  Top 0.6: v45,11 49,15 v49,15.2
  Bottom 0.24: IC29.1 44.6,10.6 v45,11
  Bottom 0.6: v49,15.2 49,17.75 L1.1
N$1  (via drill 0.35)
  Top 0.3: IC9.4 10.8,50.02 v10.8,51.2
  Bottom 0.3: v10.8,51.2 10.8,50.45 R17.P$1
N$2  (via drill 0.35)
  Top 0.3: IC1.4 6.8,50.02 v6.8,51.2
  Bottom 0.3: v6.8,51.2 6.8,50.45 R1.P$1
N$3  (via drill 0.35)
  Top 0.3: IC10.4 14.8,50.02 v14.8,51.2
  Bottom 0.3: v14.8,51.2 14.8,50.45 R19.P$1
N$4  (via drill 0.35)
  Top 0.3: IC11.4 18.8,50.02 v18.8,51.2
  Bottom 0.3: v18.8,51.2 18.8,50.45 R21.P$1
N$5  (via drill 0.35)
  Top 0.3: IC12.4 22.8,50.02 v22.8,51.2
  Bottom 0.3: v22.8,51.2 22.8,50.45 R23.P$1
N$6  (via drill 0.35)
  Top 0.3: IC13.4 26.8,50.02 v26.8,51.2
  Bottom 0.3: v26.8,51.2 26.8,50.45 R25.P$1
N$7  (via drill 0.35)
  Top 0.3: IC14.4 30.8,50.02 v30.8,51.2
  Bottom 0.3: v30.8,51.2 30.8,50.45 R27.P$1
N$8  (via drill 0.35)
  Top 0.3: IC3.4 34.8,50.02 v34.8,51.2
  Bottom 0.3: v34.8,51.2 34.8,50.45 R5.P$1
N$9  (via drill 0.35)
  Top 0.3: IC4.4 38.8,50.02 v38.8,51.2
  Bottom 0.3: v38.8,51.2 38.8,50.45 R7.P$1
N$10  (via drill 0.35)
  Top 0.3: IC5.4 42.8,50.02 v42.8,51.2
  Bottom 0.3: v42.8,51.2 42.8,50.45 R9.P$1
N$11  (via drill 0.35)
  Top 0.3: IC6.4 46.8,50.02 v46.8,51.2
  Bottom 0.3: v46.8,51.2 46.8,50.45 R11.P$1
N$12  (via drill 0.35)
  Top 0.3: IC2.4 50.8,50.02 v50.8,51.2
  Bottom 0.3: v50.8,51.2 50.8,50.45 R3.P$1
N$13  (via drill 0.35)
  Top 0.3: IC7.4 54.8,50.02 v54.8,51.2
  Bottom 0.3: v54.8,51.2 54.8,50.45 R13.P$1
N$14  (via drill 0.35)
  Top 0.3: IC8.4 58.8,50.02 v58.8,51.2
  Bottom 0.3: v58.8,51.2 58.8,50.45 R15.P$1
N$15  (via drill 0.35)
  Top 0.3: IC21.4 62.8,50.02 v62.8,51.2
  Bottom 0.3: v62.8,51.2 62.8,50.45 R39.P$1
N$16  (via drill 0.35)
  Top 0.3: IC22.4 66.8,50.02 v66.8,51.2
  Bottom 0.3: v66.8,51.2 66.8,50.45 R41.P$1
N$17  (via drill 0.35)
  Top 0.3: IC23.4 70.8,50.02 v70.8,51.2
  Bottom 0.3: v70.8,51.2 70.8,50.45 R43.P$1
N$18  (via drill 0.35)
  Top 0.3: IC24.4 74.8,50.02 v74.8,51.2
  Bottom 0.3: v74.8,51.2 74.8,50.45 R45.P$1
N$19  (via drill 0.35)
  Top 0.3: IC25.4 78.8,50.02 v78.8,51.2
  Bottom 0.3: v78.8,51.2 78.8,50.45 R47.P$1
N$20  (via drill 0.35)
  Top 0.3: IC26.4 82.8,50.02 v82.8,51.2
  Bottom 0.3: v82.8,51.2 82.8,50.45 R49.P$1
N$21  (via drill 0.35)
  Top 0.3: IC27.4 86.8,50.02 v86.8,51.2
  Bottom 0.3: v86.8,51.2 86.8,50.45 R51.P$1
N$22  (via drill 0.35)
  Top 0.3: IC17.4 90.8,50.02 v90.8,51.2
  Bottom 0.3: v90.8,51.2 90.8,50.45 R31.P$1
N$23  (via drill 0.35)
  Top 0.3: IC18.4 94.8,50.02 v94.8,51.2
  Bottom 0.3: v94.8,51.2 94.8,50.45 R33.P$1
N$24  (via drill 0.35)
  Top 0.3: IC19.4 98.8,50.02 v98.8,51.2
  Bottom 0.3: v98.8,51.2 98.8,50.45 R35.P$1
N$25  (via drill 0.35)
  Top 0.3: IC20.4 102.8,50.02 v102.8,51.2
  Bottom 0.3: v102.8,51.2 102.8,50.45 R37.P$1
N$26  (via drill 0.35)
  Top 0.3: v56.2,16.4 R56.P$2 56.2,19.8 56,20 53.2,20 53,19.8 R54.P$2
  Bottom 0.3: J1.2 59.75,16.05 59.4,16.4 v56.2,16.4 53,16.4 R54.P$2
N$27  (via drill 0.35)
  Top 0.3: v54.6,17.4 R57.P$2
  Bottom 0.3: J1.3 61,17 60.6,17.4 57.8,17.4 | 57.8,17.4 v54.6,17.4 R57.P$2 | R59.P$2 57.8,17.4
N$28
  Bottom 0.3: J1.4 62.25,17.35 61.4,18.2 60,18.2 59.4,18.8 R62.P$1 59.4,19.6 59,20 56.6,20 56.2,19.6 R61.P$1
N$29
  Bottom 0.3: J1.5 63.5,18.3 62.55,19.25 R60.P$1
N$30
  Top 0.3: IC16.4 106.95,49.81 R30.P$1
N$31
  Top 0.3: IC15.4 3.01,52.4 R29.P$1
N$35
  Bottom 0.24: IC29.5 44.6,7.2 45.2,6.6 R63.P$1
N$40
  Bottom 0.24: IC29.4 45.1,8.7 45.6,8.2 C11.1
N$42
  Bottom 0.6: C10.1 41.4,13.35 R64.P$2
SENSOR_1  (via drill 0.35)
  Top 0.3: v47,32.6 46.8,32.6 46.6,32.4 45.6,32.4 45,33 45,39.6 43,41.6 12.8,41.6 v8.6,45.8 8.01,46.39 IC1.1
  Bottom 0.3: IC28.15 47.4,33 v47,32.6 | R2.P$1 7.25,46.15 7.6,45.8 v8.6,45.8
SENSOR_2  (via drill 0.35)
  Top 0.3: v46.4,33.2 45.8,33.2 45.6,33.4 45.6,40 43.4,42.2 16.2,42.2 v12.6,45.8 12.01,46.39 IC9.1
  Bottom 0.3: IC28.16 46.7,33.5 v46.4,33.2 | R18.P$1 11.25,46.15 11.6,45.8 v12.6,45.8
SENSOR_3  (via drill 0.35)
  Top 0.3: v46.4,34.2 46.2,34.4 46.2,40.4 43.8,42.8 19.6,42.8 v16.6,45.8 16.01,46.39 IC10.1
  Bottom 0.3: IC28.17 46.6,34 v46.4,34.2 | R20.P$1 15.25,46.15 15.6,45.8 v16.6,45.8
SENSOR_4  (via drill 0.35)
  Top 0.3: v47,34.8 46.8,35 46.8,40.6 44,43.4 22.8,43.4 v20.4,45.8 20.01,46.19 IC11.1
  Bottom 0.3: IC28.18 47.3,34.5 v47,34.8 | R22.P$1 19.25,46.15 19.6,45.8 v20.4,45.8
SENSOR_5  (via drill 0.35)
  Top 0.3: v23.4,45.8 23.4,46.69 IC12.1
  Bottom 0.3: IC28.23 47,37 46.4,37.6 46.4,41.2 46,41.6 27.6,41.6 v23.4,45.8 23.25,45.95 R24.P$1
SENSOR_6  (via drill 0.35)
  Top 0.3: v27.4,45.8 27.4,46.69 IC13.1
  Bottom 0.3: IC28.24 47.3,37.5 47,37.8 47,41.4 46.2,42.2 31,42.2 v27.4,45.8 27.25,45.95 R26.P$1
SENSOR_7  (via drill 0.35)
  Top 0.3: v31.6,45.8 31.6,46.89 IC14.1
  Bottom 0.3: IC28.25 48.25,41.95 47.4,42.8 34.6,42.8 v31.6,45.8 31.25,46.15 R28.P$1
SENSOR_8  (via drill 0.35)
  Top 0.3: v35.6,45.8 35.6,46.89 IC3.1
  Bottom 0.3: IC28.26 50,43.2 49.8,43.4 38,43.4 v35.6,45.8 35.25,46.15 R6.P$1
SENSOR_9  (via drill 0.35)
  Top 0.3: v39.6,45.8 39.6,46.89 IC4.1
  Bottom 0.3: IC28.29 51.5,43.9 51.4,44 41.4,44 v39.6,45.8 39.25,46.15 R8.P$1
SENSOR_10  (via drill 0.35)
  Top 0.3: v43.4,45.8 43.4,46.69 IC5.1
  Bottom 0.3: IC28.30 52,44.6 44.6,44.6 v43.4,45.8 43.25,45.95 R10.P$1
SENSOR_11  (via drill 0.35)
  Top 0.3: v47.6,45.8 47.6,46.89 IC6.1
  Bottom 0.3: IC28.31 52.5,45.1 52.4,45.2 48.2,45.2 v47.6,45.8 47.25,46.15 R12.P$1
SENSOR_12  (via drill 0.35)
  Top 0.3: v51.4,46 51.4,46.69 IC2.1
  Bottom 0.3: IC28.32 53,45.4 52.6,45.8 51.6,45.8 v51.4,46 51.25,46.15 R4.P$1
SENSOR_13  (via drill 0.35)
  Top 0.3: v54.3,46.3 55.3,47.3 IC7.1
  Bottom 0.3: IC28.33 53.5,45.5 v54.3,46.3 55,47 R14.P$1
SENSOR_14  (via drill 0.35)
  Top 0.3: v58.6,45.8 58.6,45.89 IC8.1
  Bottom 0.3: IC28.34 54,45 54.2,45.2 58,45.2 v58.6,45.8 59.25,46.45 R16.P$1
SENSOR_15  (via drill 0.35)
  Top 0.3: v63,45.8 63,46.29 IC21.1
  Bottom 0.3: IC28.35 54.5,44.5 54.6,44.6 61.8,44.6 v63,45.8 63.25,46.05 R40.P$1
SENSOR_16  (via drill 0.35)
  Top 0.3: v66.8,45.8 66.8,46.09 IC22.1
  Bottom 0.3: R42.P$1 67.25,46.25 v66.8,45.8 65,44 55,44 IC28.36
SENSOR_17  (via drill 0.35)
  Top 0.3: v70.8,45.8 70.8,46.09 IC23.1
  Bottom 0.3: IC28.37 55.5,43.3 55.6,43.4 68.4,43.4 v70.8,45.8 71.25,46.25 R44.P$1
SENSOR_18  (via drill 0.35)
  Top 0.3: IC24.1 75,46.29 v75,45.8
  Bottom 0.3: IC28.38 56,42.8 72,42.8 v75,45.8 75.25,46.05 R46.P$1
SENSOR_19  (via drill 0.35)
  Top 0.3: v79,45.8 79,46.29 IC25.1
  Bottom 0.3: IC28.39 56.5,42.1 56.6,42.2 75.4,42.2 v79,45.8 79.25,46.05 R48.P$1
SENSOR_20  (via drill 0.35)
  Top 0.3: v83,45.8 83,46.29 IC26.1
  Bottom 0.3: IC28.40 57,41.6 78.8,41.6 v83,45.8 83.25,46.05 R50.P$1
SENSOR_21  (via drill 0.35)
  Top 0.3: v87,45.8 87,46.29 IC27.1
  Bottom 0.3: IC28.41 57.5,40.9 57.6,41 82.2,41 v87,45.8 87.25,46.05 R52.P$1
SENSOR_22  (via drill 0.35)
  Top 0.3: v91,45.8 91,46.29 IC17.1
  Bottom 0.3: R32.P$1 91.25,46.05 v91,45.8 85.6,40.4 67.2,40.4 64.8,38 IC28.51
SENSOR_23  (via drill 0.35)
  Top 0.3: v95,45.8 95,46.29 IC18.1
  Bottom 0.3: IC28.52 65.1,37.5 67.4,39.8 89,39.8 v95,45.8 95.25,46.05 R34.P$1
SENSOR_24  (via drill 0.35)
  Top 0.3: v98.8,45.8 98.8,46.09 IC19.1
  Bottom 0.3: R36.P$1 99.25,46.25 v98.8,45.8 92.2,39.2 67.6,39.2 65.4,37 IC28.53
SENSOR_25  (via drill 0.35)
  Top 0.3: v103,45.8 103,46.29 IC20.1
  Bottom 0.3: IC28.54 65.7,36.5 67.8,38.6 95.8,38.6 v103,45.8 103.25,46.05 R38.P$1
SPI3_MISO
  Bottom 0.3: IC28.79 60.5,22.5 60.2,22.2 59,22.2 57.8,21 R59.P$1
SPI3_MOSI  (via drill 0.35)
  Top 0.3: R56.P$1 58.45,23 v59.6,23
  Bottom 0.3: IC28.80 60,23.4 v59.6,23
SPI3_NSS
  Bottom 0.3: IC28.77 61.5,21.25 R60.P$2
SPI3_SCK
  Bottom 0.3: IC28.78 61,21.8 60.8,21.6 60,21.6 59.4,21 R62.P$2
STLINK_SWO  (via drill 0.35)
  Top 0.3: v65.2,26.4 65.2,26.8 62.6,29.4 57.8,29.4 55.6,27.2 v55.6,26.4
  Bottom 0.3: v65.2,26.4 66.95,26.4 J2.5 | IC28.89 55.5,26.3 v55.6,26.4
STLINK_TCK
  Bottom 0.3: IC28.76 65.05,24.25 65.9,25.1 J2.6
STLINK_TMS
  Bottom 0.3: IC28.72 66.9,27.5 J2.4
STLINK_USART1_RX
  Bottom 0.3: J2.3 65.35,28.85 65.2,29 IC28.69
STLINK_USART1_TX
  Bottom 0.3: J2.2 65.7,30.1 65.1,29.5 IC28.68
USART2_RX  (via drill 0.35)
  Top 0.3: v56.2,23 55.4,22.2 54.2,22.2 53,21 R55.P$1
  Bottom 0.3: IC28.87 56.5,23.3 v56.2,23
USART2_TX  (via drill 0.35)
  Top 0.3: v57.2,23 55.8,21.6 55,21.6 54.6,21.2 R58.P$1
  Bottom 0.3: IC28.86 57,23.2 v57.2,23
VBAT  (via drill 0.35)
  Top 0.6: v40.8,8.4 v50.6,8.4
  Bottom 0.24: IC29.2 46.7,9.7 48.75,11.75 C12.P$1 | IC29.7 41.1,8.7 v40.8,8.4
  pour Bottom (isolate 0.24, no thermals): 51.5,6 52,7 52,10.6 50,10.6 50,6
  pour Bottom (no thermals): 52,9.8 52,14 48.4,14 48.4,12 46,10.8 46,9.8
VDD  (via drill 0.35)  (34 unrouted)
  Top 0.3: v5.6,52.4 R29.P$2 | v105.4,53.8 105.4,52.4 R30.P$2
  Top 0.6: v40.8,9.4 41.4,10 v41.4,17.6 | v62.4,38.4 62.35,38.35 C9.1 62.35,36.95 61.6,36.2 v61.4,36.2 | v51.4,38.4 51.55,38.25 C2.1 v52.6,37.4 | v49.6,36 49.75,36.15 C6.1 C4.1 52.25,36.2 v53.4,36.2 | v49.6,31.2 49.75,31.35 C1.1 50.65,31.4 v51.8,31.4 | v62.4,25.6 62.35,25.65 C7.1 60.75,25.65 60,26.4 v60,26.6 | C8.1 v49.6,28.4
  Bottom 0.24: IC29.8 41,9.2 v40.8,9.4
  Bottom 0.3: IC28.75 62.8,26 v62.4,25.6 | IC28.50 62,38.8 v62.4,38.4 | IC28.28 51,38.8 v51.4,38.4 | IC28.22 IC28.21 v49.6,36 | IC28.6 49.5,28.5 v49.6,28.4 | IC28.11 49.4,31 v49.6,31.2 | IC28.100 50,23.4 49.45,22.85 C5.1 | R2.P$2 R1.P$2 8.75,51.8 8.8,51.8 | R18.P$2 R17.P$2 12.75,51.8 12.8,51.8 | R20.P$2 R19.P$2 16.75,51.8 16.8,51.8 | R22.P$2 R21.P$2 20.75,51.8 20.8,51.8 | R24.P$2 R23.P$2 24.75,51.8 24.8,51.8 | R26.P$2 R25.P$2 28.75,51.8 28.8,51.8 | R28.P$2 R27.P$2 32.75,51.8 32.8,51.8 | R6.P$2 R5.P$2 36.75,51.8 36.8,51.8 | R8.P$2 R7.P$2 40.75,51.8 40.8,51.8 | R10.P$2 R9.P$2 44.8,50 44.8,51.8 | R12.P$2 R11.P$2 48.75,51.8 48.8,51.8 | R4.P$2 R3.P$2 52.75,51.8 53,51.8 | R14.P$2 R13.P$2 56.8,50 56.8,51.8 | R16.P$2 R15.P$2 60.75,51.8 60.8,51.8 | R40.P$2 R39.P$2 64.75,51.8 64.8,51.8 | R42.P$2 R41.P$2 68.75,51.8 68.8,51.8 | R44.P$2 R43.P$2 72.8,50 72.8,51.8 | R46.P$2 R45.P$2 76.75,51.8 76.8,51.8 | R48.P$2 R47.P$2 80.75,51.8 80.8,51.8 | R50.P$2 R49.P$2 84.8,50 84.8,51.8 | R52.P$2 R51.P$2 88.75,51.8 88.8,51.8 | R32.P$2 R31.P$2 92.75,51.8 92.8,51.8 | R34.P$2 R33.P$2 96.75,51.8 96.8,51.8 | R36.P$2 R35.P$2 100.8,50 100.8,51.8 | R38.P$2 R37.P$2 104.75,51.8 104.8,51.8
  Bottom 0.6: R64.P$1 v41.4,17.6 41.6,17.8 L1.2 43.35,19.35 | C5.1 48,22.4 47.2,23.2 | 47.6,24.6 48.6,24.6 51.2,27.2 51.2,28.4 v49.6,28.4
  pour Bottom (isolate 0.3): 61.8,26.2 61.8,37.8 50.2,37.8 50.2,26.2
  pour Bottom (isolate 0.3, no thermals): 44,17.6 44,21 46.8,22.2 48,22.2 48,24.8 45.4,24.8 45.4,40.8 10.81,40.78 6,45.32 6,51.6 105.79,51.6 105.81,59.8 0.2,59.8 0.2,36.2 40.2,36.4 40.2,17.6

### Text on the board
tNames: S1 | S25 | VAR1A REV 2.0 2019-03-03